# Altium schematic sheet Top_Sheet.SchDoc
size Legal
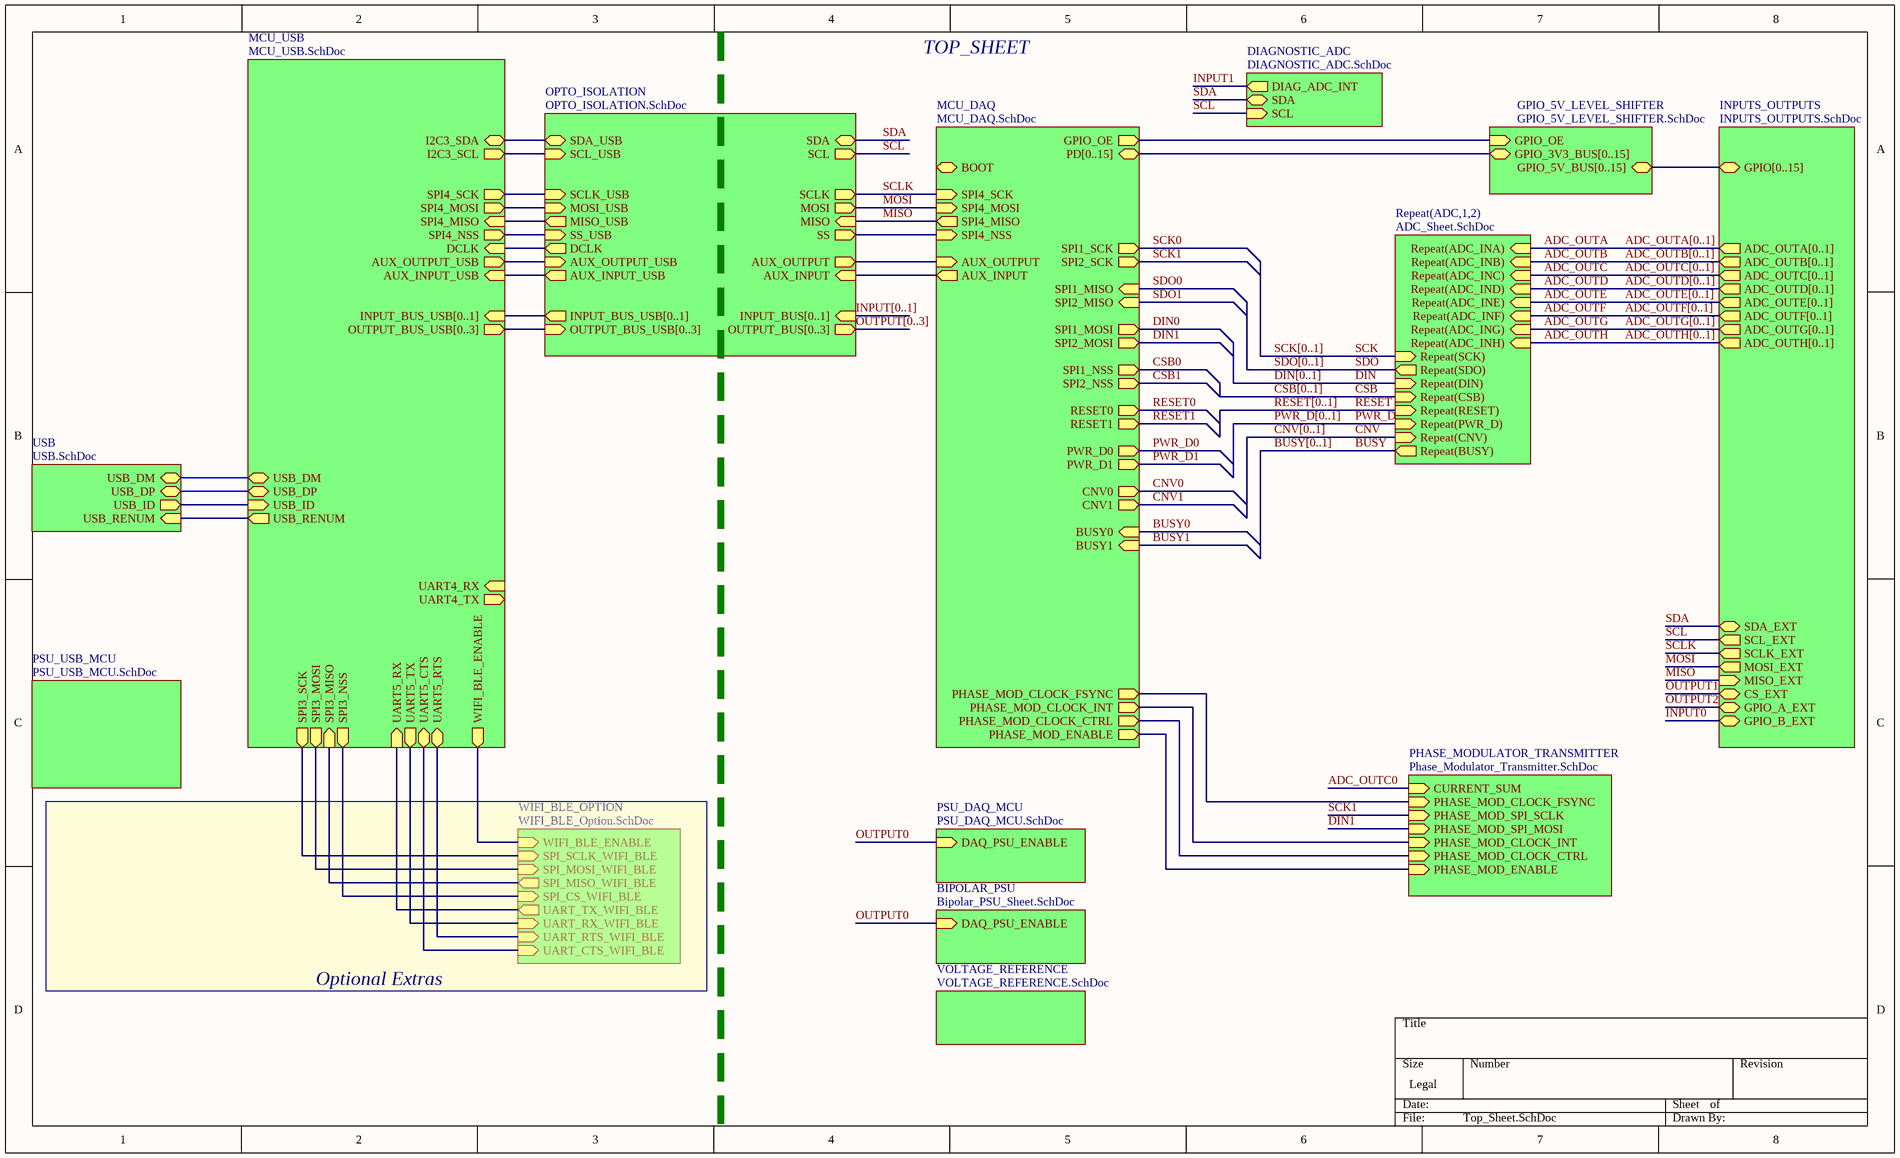
[diagram p0: Top_Sheet.SchDoc]

## Sub-sheets
BIPOLAR_PSU = Bipolar_PSU_Sheet.SchDoc: DAQ_PSU_ENABLE (in)
DIAGNOSTIC_ADC = DIAGNOSTIC_ADC.SchDoc: SCL (in), SDA (bidir), DIAG_ADC_INT (out)
GPIO_5V_LEVEL_SHIFTER = GPIO_5V_LEVEL_SHIFTER.SchDoc: GPIO_OE (in), GPIO_3V3_BUS[0..15] (bidir), GPIO_5V_BUS[0..15] (bidir)
INPUTS_OUTPUTS = INPUTS_OUTPUTS.SchDoc: SDA_EXT (bidir), SCL_EXT (out), SCLK_EXT (out), MOSI_EXT (out), MISO_EXT (in), GPIO_B_EXT, GPIO_A_EXT, GPIO[0..15] (bidir), CS_EXT, ADC_OUTA[0..1] (out), ADC_OUTB[0..1] (out), ADC_OUTC[0..1] (out), ADC_OUTD[0..1] (out), ADC_OUTE[0..1] (out), ADC_OUTF[0..1] (out), ADC_OUTG[0..1] (out), ADC_OUTH[0..1] (out)
MCU_DAQ = MCU_DAQ.SchDoc: BOOT, SPI4_NSS (in), SPI4_SCK (in), SPI4_MISO (out), SPI4_MOSI (in), SPI1_NSS (out), SPI1_SCK (out), SPI1_MISO (in), SPI1_MOSI (out), SPI2_NSS (out), SPI2_SCK (out), SPI2_MISO (in), SPI2_MOSI (out), PD[0..15] (bidir), CNV0 (out), RESET0 (out), BUSY0 (in), CNV1 (out), RESET1 (out), BUSY1 (in), PHASE_MOD_CLOCK_FSYNC (out), PHASE_MOD_CLOCK_INT (out), PHASE_MOD_CLOCK_CTRL (out), PHASE_MOD_ENABLE (out), AUX_INPUT (out), AUX_OUTPUT (in), GPIO_OE (out), PWR_D0 (out), PWR_D1 (out)
MCU_USB = MCU_USB.SchDoc: USB_ID (in), USB_RENUM (out), WIFI_BLE_ENABLE (out), DCLK (in), AUX_OUTPUT_USB (out), AUX_INPUT_USB (in), USB_DP (bidir), USB_DM (bidir), SPI4_NSS (out), SPI4_SCK (out), SPI4_MISO (in), SPI4_MOSI (out), UART5_CTS (bidir), UART5_RTS (bidir), SPI3_MOSI (out), SPI3_MISO (in), SPI3_NSS (out), SPI3_SCK (out), UART4_RX (in), UART4_TX (out), UART5_RX (in), UART5_TX (out), I2C3_SDA (bidir), I2C3_SCL (out), INPUT_BUS_USB[0..1] (in), OUTPUT_BUS_USB[0..3] (out)
OPTO_ISOLATION = OPTO_ISOLATION.SchDoc: SCL_USB (in), SDA_USB (bidir), SDA (bidir), SCLK_USB (in), MOSI_USB (in), MISO_USB (out), MISO (in), SS_USB (in), SS (out), DCLK (out), AUX_OUTPUT_USB (in), AUX_OUTPUT (out), AUX_INPUT_USB (out), AUX_INPUT (in), INPUT_BUS_USB[0..1] (out), OUTPUT_BUS_USB[0..3] (in), INPUT_BUS[0..1] (in), OUTPUT_BUS[0..3] (out), SCLK (out), MOSI (out), SCL (out)
PHASE_MODULATOR_TRANSMITTER = Phase_Modulator_Transmitter.SchDoc: CURRENT_SUM (in), PHASE_MOD_CLOCK_FSYNC (in), PHASE_MOD_SPI_SCLK (in), PHASE_MOD_SPI_MOSI (in), PHASE_MOD_ENABLE (in), PHASE_MOD_CLOCK_INT (in), PHASE_MOD_CLOCK_CTRL (in)
PSU_DAQ_MCU = PSU_DAQ_MCU.SchDoc: DAQ_PSU_ENABLE (in)
PSU_USB_MCU = PSU_USB_MCU.SchDoc: no entries
Repeat(ADC,1,2) = ADC_Sheet.SchDoc: Repeat(SCK) (in), Repeat(SDO) (out), Repeat(DIN) (in), Repeat(CNV) (in), Repeat(RESET) (in), Repeat(PWR_D) (in), Repeat(CSB) (in), Repeat(BUSY) (out), Repeat(ADC_INF) (in), Repeat(ADC_INB) (in), Repeat(ADC_INH) (in), Repeat(ADC_INC) (in), Repeat(ADC_INA) (in), Repeat(ADC_INE) (in), Repeat(ADC_IND) (in), Repeat(ADC_ING) (in)
USB = USB.SchDoc: USB_DM (bidir), USB_DP (bidir), USB_ID (out), USB_RENUM (in)
VOLTAGE_REFERENCE = VOLTAGE_REFERENCE.SchDoc: no entries
WIFI_BLE_OPTION = WIFI_BLE_Option.SchDoc: SPI_CS_WIFI_BLE (in), SPI_MOSI_WIFI_BLE (in), SPI_MISO_WIFI_BLE (out), SPI_SCLK_WIFI_BLE (in), UART_RX_WIFI_BLE (in), UART_TX_WIFI_BLE (out), UART_RTS_WIFI_BLE (in), UART_CTS_WIFI_BLE (in), WIFI_BLE_ENABLE (in)

## Nets
ADC_OUTA: sheet Repeat(ADC,1,2)/Repeat(ADC_INA)
ADC_OUTB: sheet Repeat(ADC,1,2)/Repeat(ADC_INB)
ADC_OUTC: sheet Repeat(ADC,1,2)/Repeat(ADC_INC)
ADC_OUTC0: sheet PHASE_MODULATOR_TRANSMITTER/CURRENT_SUM
ADC_OUTD: sheet Repeat(ADC,1,2)/Repeat(ADC_IND)
ADC_OUTE: sheet Repeat(ADC,1,2)/Repeat(ADC_INE)
ADC_OUTF: sheet Repeat(ADC,1,2)/Repeat(ADC_INF)
ADC_OUTG: sheet Repeat(ADC,1,2)/Repeat(ADC_ING)
ADC_OUTH: sheet Repeat(ADC,1,2)/Repeat(ADC_INH)
BUSY: sheet Repeat(ADC,1,2)/Repeat(BUSY)
BUSY0: sheet MCU_DAQ/BUSY0
BUSY1: sheet MCU_DAQ/BUSY1
CNV: sheet Repeat(ADC,1,2)/Repeat(CNV)
CNV0: sheet MCU_DAQ/CNV0
CNV1: sheet MCU_DAQ/CNV1
CSB: sheet Repeat(ADC,1,2)/Repeat(CSB)
CSB0: sheet MCU_DAQ/SPI1_NSS
CSB1: sheet MCU_DAQ/SPI2_NSS
DIN: sheet Repeat(ADC,1,2)/Repeat(DIN)
DIN0: sheet MCU_DAQ/SPI1_MOSI
DIN1: sheet MCU_DAQ/SPI2_MOSI, sheet PHASE_MODULATOR_TRANSMITTER/PHASE_MOD_SPI_MOSI
INPUT0: sheet INPUTS_OUTPUTS/GPIO_B_EXT
INPUT1: sheet DIAGNOSTIC_ADC/DIAG_ADC_INT
MISO: sheet OPTO_ISOLATION/MISO, sheet MCU_DAQ/SPI4_MISO, sheet INPUTS_OUTPUTS/MISO_EXT
MOSI: sheet OPTO_ISOLATION/MOSI, sheet MCU_DAQ/SPI4_MOSI, sheet INPUTS_OUTPUTS/MOSI_EXT
OUTPUT0: sheet BIPOLAR_PSU/DAQ_PSU_ENABLE, sheet PSU_DAQ_MCU/DAQ_PSU_ENABLE
OUTPUT1: sheet INPUTS_OUTPUTS/CS_EXT
OUTPUT2: sheet INPUTS_OUTPUTS/GPIO_A_EXT
PWR_D: sheet Repeat(ADC,1,2)/Repeat(PWR_D)
PWR_D0: sheet MCU_DAQ/PWR_D0
PWR_D1: sheet MCU_DAQ/PWR_D1
RESET: sheet Repeat(ADC,1,2)/Repeat(RESET)
RESET0: sheet MCU_DAQ/RESET0
RESET1: sheet MCU_DAQ/RESET1
SCK: sheet Repeat(ADC,1,2)/Repeat(SCK)
SCK0: sheet MCU_DAQ/SPI1_SCK
SCK1: sheet MCU_DAQ/SPI2_SCK, sheet PHASE_MODULATOR_TRANSMITTER/PHASE_MOD_SPI_SCLK
SCL: sheet OPTO_ISOLATION/SCL, sheet DIAGNOSTIC_ADC/SCL, sheet INPUTS_OUTPUTS/SCL_EXT
SCLK: sheet OPTO_ISOLATION/SCLK, sheet MCU_DAQ/SPI4_SCK, sheet INPUTS_OUTPUTS/SCLK_EXT
SDA: sheet OPTO_ISOLATION/SDA, sheet DIAGNOSTIC_ADC/SDA, sheet INPUTS_OUTPUTS/SDA_EXT
SDO: sheet Repeat(ADC,1,2)/Repeat(SDO)
SDO0: sheet MCU_DAQ/SPI1_MISO
SDO1: sheet MCU_DAQ/SPI2_MISO
(unnamed): sheet USB/USB_DM, sheet MCU_USB/USB_DM
(unnamed): sheet USB/USB_DP, sheet MCU_USB/USB_DP
(unnamed): sheet USB/USB_ID, sheet MCU_USB/USB_ID
(unnamed): sheet USB/USB_RENUM, sheet MCU_USB/USB_RENUM
(unnamed): sheet OPTO_ISOLATION/SCL_USB, sheet MCU_USB/I2C3_SCL
(unnamed): sheet OPTO_ISOLATION/SDA_USB, sheet MCU_USB/I2C3_SDA
(unnamed): sheet OPTO_ISOLATION/SCLK_USB, sheet MCU_USB/SPI4_SCK
(unnamed): sheet OPTO_ISOLATION/MOSI_USB, sheet MCU_USB/SPI4_MOSI
(unnamed): sheet OPTO_ISOLATION/MISO_USB, sheet MCU_USB/SPI4_MISO
(unnamed): sheet OPTO_ISOLATION/SS_USB, sheet MCU_USB/SPI4_NSS
(unnamed): sheet OPTO_ISOLATION/SS, sheet MCU_DAQ/SPI4_NSS
(unnamed): sheet OPTO_ISOLATION/DCLK, sheet MCU_USB/DCLK
(unnamed): sheet OPTO_ISOLATION/AUX_OUTPUT_USB, sheet MCU_USB/AUX_OUTPUT_USB
(unnamed): sheet OPTO_ISOLATION/AUX_OUTPUT, sheet MCU_DAQ/AUX_OUTPUT
(unnamed): sheet OPTO_ISOLATION/AUX_INPUT_USB, sheet MCU_USB/AUX_INPUT_USB
(unnamed): sheet OPTO_ISOLATION/AUX_INPUT, sheet MCU_DAQ/AUX_INPUT
(unnamed): sheet WIFI_BLE_OPTION/SPI_CS_WIFI_BLE, sheet MCU_USB/SPI3_NSS
(unnamed): sheet WIFI_BLE_OPTION/SPI_MOSI_WIFI_BLE, sheet MCU_USB/SPI3_MOSI
(unnamed): sheet WIFI_BLE_OPTION/SPI_MISO_WIFI_BLE, sheet MCU_USB/SPI3_MISO
(unnamed): sheet WIFI_BLE_OPTION/SPI_SCLK_WIFI_BLE, sheet MCU_USB/SPI3_SCK
(unnamed): sheet WIFI_BLE_OPTION/UART_RX_WIFI_BLE, sheet MCU_USB/UART5_TX
(unnamed): sheet WIFI_BLE_OPTION/UART_TX_WIFI_BLE, sheet MCU_USB/UART5_RX
(unnamed): sheet WIFI_BLE_OPTION/UART_RTS_WIFI_BLE, sheet MCU_USB/UART5_RTS
(unnamed): sheet WIFI_BLE_OPTION/UART_CTS_WIFI_BLE, sheet MCU_USB/UART5_CTS
(unnamed): sheet WIFI_BLE_OPTION/WIFI_BLE_ENABLE, sheet MCU_USB/WIFI_BLE_ENABLE
(unnamed): sheet MCU_DAQ/PHASE_MOD_CLOCK_FSYNC, sheet PHASE_MODULATOR_TRANSMITTER/PHASE_MOD_CLOCK_FSYNC
(unnamed): sheet MCU_DAQ/PHASE_MOD_CLOCK_INT, sheet PHASE_MODULATOR_TRANSMITTER/PHASE_MOD_CLOCK_INT
(unnamed): sheet MCU_DAQ/PHASE_MOD_CLOCK_CTRL, sheet PHASE_MODULATOR_TRANSMITTER/PHASE_MOD_CLOCK_CTRL
(unnamed): sheet MCU_DAQ/PHASE_MOD_ENABLE, sheet PHASE_MODULATOR_TRANSMITTER/PHASE_MOD_ENABLE
(unnamed): sheet MCU_DAQ/GPIO_OE, sheet GPIO_5V_LEVEL_SHIFTER/GPIO_OE

## Buses and harness runs
bus ADC_OUTA[0..1] = sheet INPUTS_OUTPUTS/ADC_OUTA[0..1]
bus ADC_OUTB[0..1] = sheet INPUTS_OUTPUTS/ADC_OUTB[0..1]
bus ADC_OUTC[0..1] = sheet INPUTS_OUTPUTS/ADC_OUTC[0..1]
bus ADC_OUTD[0..1] = sheet INPUTS_OUTPUTS/ADC_OUTD[0..1]
bus ADC_OUTE[0..1] = sheet INPUTS_OUTPUTS/ADC_OUTE[0..1]
bus ADC_OUTF[0..1] = sheet INPUTS_OUTPUTS/ADC_OUTF[0..1]
bus ADC_OUTG[0..1] = sheet INPUTS_OUTPUTS/ADC_OUTG[0..1]
bus ADC_OUTH[0..1] = sheet INPUTS_OUTPUTS/ADC_OUTH[0..1]
bus BUSY[0..1]
bus CNV[0..1]
bus CSB[0..1]
bus DIN[0..1]
bus INPUT[0..1] = sheet OPTO_ISOLATION/INPUT_BUS[0..1]
bus OUTPUT[0..3] = sheet OPTO_ISOLATION/OUTPUT_BUS[0..3]
bus PWR_D[0..1]
bus RESET[0..1]
bus SCK[0..1]
bus SDO[0..1]
bus sheet GPIO_5V_LEVEL_SHIFTER/GPIO_3V3_BUS[0..15] = sheet MCU_DAQ/PD[0..15]
bus sheet GPIO_5V_LEVEL_SHIFTER/GPIO_5V_BUS[0..15] = sheet INPUTS_OUTPUTS/GPIO[0..15]
bus sheet MCU_USB/INPUT_BUS_USB[0..1] = sheet OPTO_ISOLATION/INPUT_BUS_USB[0..1]
bus sheet MCU_USB/OUTPUT_BUS_USB[0..3] = sheet OPTO_ISOLATION/OUTPUT_BUS_USB[0..3]

## Notes on the sheet
- TOP_SHEET
- Optional Extras